# Altium schematic sheet LED.SchDoc: LED
size 420 x 297 mm; SheetNumber: 11; SheetTotal: 12
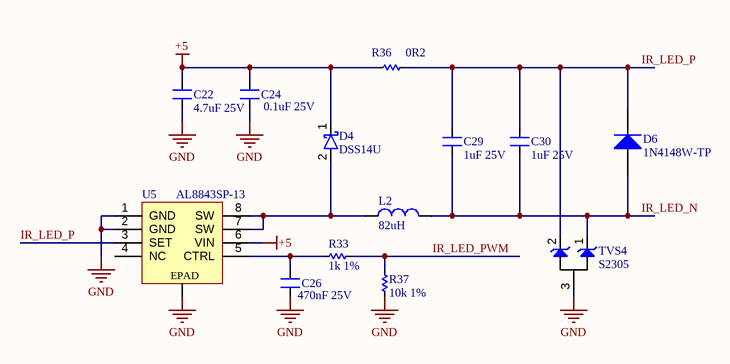
[diagram p0: LED.SchDoc]

## Parts
C22  4.7uF 25V  [CN-SMD-0603-EXP-V101]
C24  0.1uF 25V  [CN-SMD-0603-EXP-V101]
C26  470nF 25V  [CN-SMD-0603-EXP-V101]
C29  1uF 25V  [CN-SMD-0603-EXP-V101]
C30  1uF 25V  [CN-SMD-0603-EXP-V101]
D4  DSS14U  [SOD-123-EXP-V101]
D6  1N4148W-TP  [SOD-123-EXP-V101]
L2  82uH  [L-SMD-M-4.8x4.8x2.8mm]
R33  1k 1%  [RES-SMD-0603-EXP-V101]
R36  0R2  [RES-SMD-1206-EXP-V101]
R37  10k 1%  [RES-SMD-0603-EXP-V101]
TVS4  S2305  [sot23-12_3]
U5  AL8843SP-13  [SO8_EPAD]

## Nets
+5: C22.2 C24.2 D4.1 R36.2 U5.6(VIN)
GND: C22.1 C24.1 C26.1 R37.1 TVS4.3 U5.1(GND) U5.2(GND) U5.EPAD
IR_LED_N: C29.1 C30.1 D6.2(A) L2.2 TVS4.1
IR_LED_P: C29.2 C30.2 D6.1(K) R36.1 TVS4.2 U5.3(SET)
IR_LED_PWM: R33.2 R37.2
NetC26_2: C26.2 R33.1 U5.5(CTRL)
NetD4_2: D4.2 L2.1 U5.7(SW) U5.8(SW)

Not connected (* = marked no-connect by the designer): U5 4(NC)

## Notes on the sheet
- Project:
- PEE-PC1
- Sub-system:
- NANORACK_EXP_CONTROLLER
- Design by:
- SANG HUYNH
- BAO BUI Q.
- Sheet title:
- Sheet
- A3
- of
- Checked by:
- Approved by:
- VU PHAM
- Revision:
- Document No:
- V1.0.0
- Size:
- Date:

## Library data of the parts
C22 C24 C26 C29 C30 = Capacitors: Value: 33pF
D6 = 1N4148W-TP: DIODE GEN PURP 100V 300MA SOD123; MPN: 1N4148W-7-F; MFR: Diodes Incorporated; Solder: SMT; Value: 100V/300MA
L2 = L-SMD-1: SRR4828A-820M; partNo: 78477010; Manufacturer: Wurth Elektronik; Inductance: 1.0 μH; ComponentLink1Description: Manufacturer; ComponentLink1URL: http://www.we-online.de; Created by: Baojun Chen; Created Date: Nov.2015; ComponentLink2Description: Datasheet; ComponentLink2URL: http://katalog.we-online.de/pbs/datasheet/78477010.pdf
R33 R37 = Res SMD: SMD; Manufacturer: Generic Components; Class: Passive; Published: 08/06/2000; Publisher: Altium Hobart Technology Centre
R36 = Res-SMD: RES 0.1 OHM 1% 1W 1206 / PN: PE1206FRF470R1L; Manufacturer: Generic Components; Class: Passive; Published: 08/06/2000; Publisher: Altium Hobart Technology Centre
TVS4 = S2305: TVS DIODE 5VWM 10.8VC SOT23
U5 = AL8843SP-13: IC LED DRIVER RGLTR PWM 3A 8SO